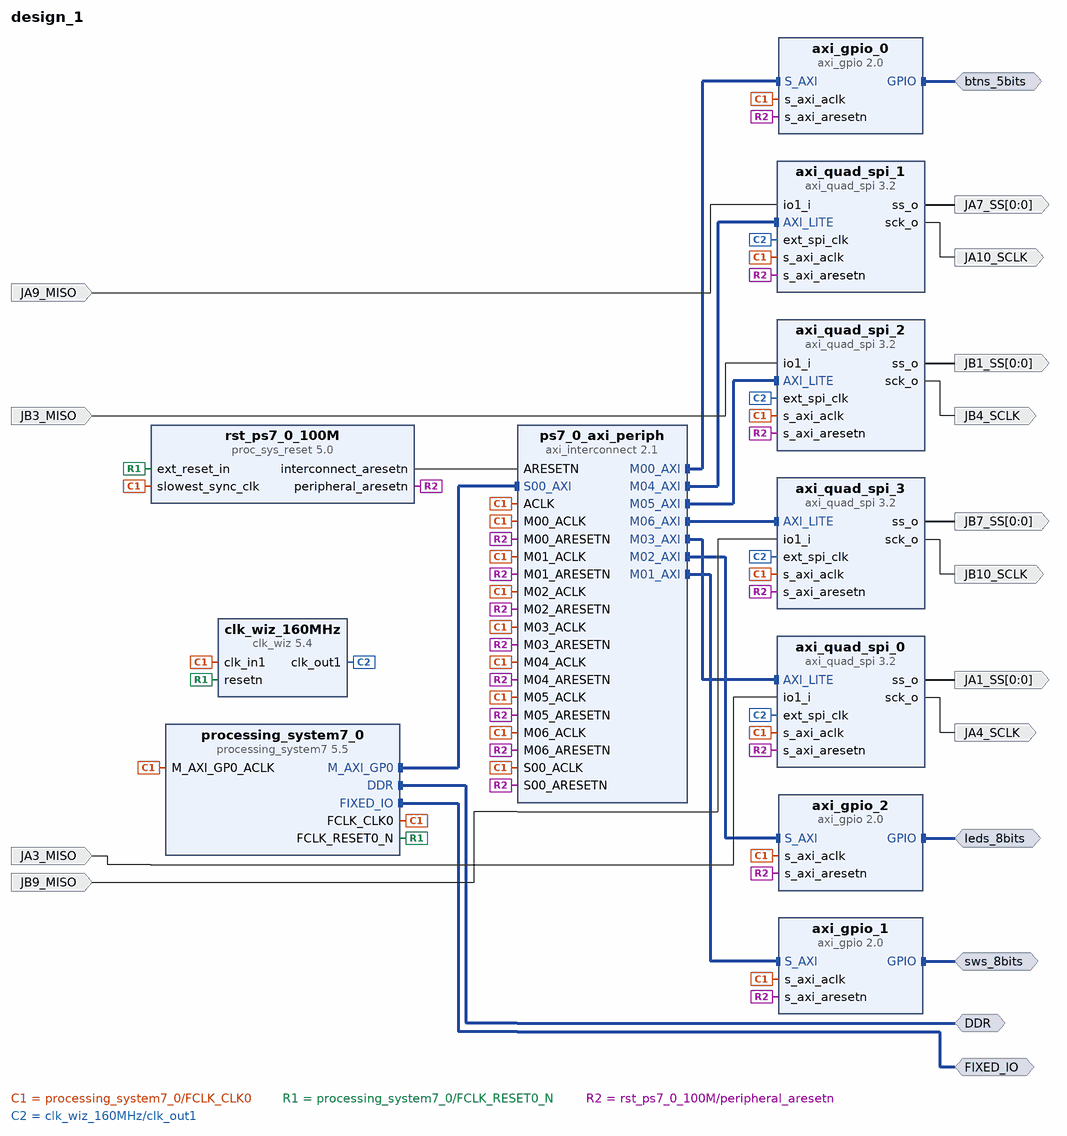
[diagram p0: block diagram of the top level]
# Vivado block design design_1, xc7z020clg484-1, Vivado 2017.1_sdx
create_bd_design design_1

create_bd_intf_port -mode Master -vlnv xilinx.com:interface:ddrx_rtl:1.0 DDR
create_bd_intf_port -mode Master -vlnv xilinx.com:display_processing_system7:fixedio_rtl:1.0 FIXED_IO
create_bd_intf_port -mode Master -vlnv xilinx.com:interface:gpio_rtl:1.0 btns_5bits
create_bd_intf_port -mode Master -vlnv xilinx.com:interface:gpio_rtl:1.0 sws_8bits
create_bd_intf_port -mode Master -vlnv xilinx.com:interface:gpio_rtl:1.0 leds_8bits
create_bd_port -dir O -type clk JA4_SCLK
create_bd_port -dir I JA3_MISO
create_bd_port -dir O -from 0 -to 0 JA1_SS
create_bd_port -dir O -from 0 -to 0 JA7_SS
create_bd_port -dir O -from 0 -to 0 JB1_SS
create_bd_port -dir O -from 0 -to 0 JB7_SS
create_bd_port -dir I JA9_MISO
create_bd_port -dir I JB3_MISO
create_bd_port -dir O -type clk JA10_SCLK
create_bd_port -dir O -type clk JB4_SCLK
create_bd_port -dir O -type clk JB10_SCLK
create_bd_port -dir I JB9_MISO

create_bd_cell -type ip -vlnv xilinx.com:ip:processing_system7:5.5 processing_system7_0
set_property -dict [list \
  CONFIG.PCW_FPGA0_PERIPHERAL_FREQMHZ 100 \
  CONFIG.PCW_FPGA1_PERIPHERAL_FREQMHZ 160 \
  CONFIG.PCW_UART0_BAUD_RATE 921600 \
  CONFIG.PCW_QSPI_GRP_SINGLE_SS_ENABLE 1 \
  CONFIG.PCW_UART0_PERIPHERAL_ENABLE 1 \
  CONFIG.PCW_UART0_UART0_IO {MIO 10 .. 11} \
  CONFIG.preset ZedBoard \
] [get_bd_cells processing_system7_0]
# 9 more settings of processing_system7_0 are not shown: defaults, MIO pin electricals, DDR timing, and values the tool derives
create_bd_cell -type ip -vlnv xilinx.com:ip:axi_gpio:2.0 axi_gpio_0
set_property -dict [list \
  CONFIG.C_INTERRUPT_PRESENT 0 \
  CONFIG.USE_BOARD_FLOW true \
  CONFIG.GPIO_BOARD_INTERFACE btns_5bits \
] [get_bd_cells axi_gpio_0]
create_bd_cell -type ip -vlnv xilinx.com:ip:axi_gpio:2.0 axi_gpio_1
set_property -dict [list \
  CONFIG.C_INTERRUPT_PRESENT 0 \
  CONFIG.USE_BOARD_FLOW true \
  CONFIG.GPIO_BOARD_INTERFACE sws_8bits \
] [get_bd_cells axi_gpio_1]
create_bd_cell -type ip -vlnv xilinx.com:ip:axi_gpio:2.0 axi_gpio_2
set_property -dict [list \
  CONFIG.C_INTERRUPT_PRESENT 0 \
  CONFIG.USE_BOARD_FLOW true \
  CONFIG.GPIO_BOARD_INTERFACE leds_8bits \
] [get_bd_cells axi_gpio_2]
create_bd_cell -type ip -vlnv xilinx.com:ip:axi_interconnect:2.1 ps7_0_axi_periph
set_property -dict {CONFIG.NUM_MI 7} [get_bd_cells ps7_0_axi_periph]
create_bd_cell -type ip -vlnv xilinx.com:ip:axi_quad_spi:3.2 axi_quad_spi_0
set_property -dict [list \
  CONFIG.C_USE_STARTUP 0 \
  CONFIG.C_NUM_TRANSFER_BITS 16 \
  CONFIG.C_NUM_SS_BITS 1 \
  CONFIG.C_SCK_RATIO 2 \
  CONFIG.C_FIFO_DEPTH 16 \
  CONFIG.FIFO_INCLUDED 1 \
  CONFIG.Multiples16 4 \
] [get_bd_cells axi_quad_spi_0]
create_bd_cell -type ip -vlnv xilinx.com:ip:axi_quad_spi:3.2 axi_quad_spi_1
set_property -dict [list \
  CONFIG.C_USE_STARTUP 0 \
  CONFIG.C_NUM_TRANSFER_BITS 16 \
  CONFIG.C_NUM_SS_BITS 1 \
  CONFIG.C_SCK_RATIO 2 \
  CONFIG.C_FIFO_DEPTH 16 \
  CONFIG.FIFO_INCLUDED 1 \
  CONFIG.Multiples16 4 \
] [get_bd_cells axi_quad_spi_1]
create_bd_cell -type ip -vlnv xilinx.com:ip:axi_quad_spi:3.2 axi_quad_spi_2
set_property -dict [list \
  CONFIG.C_USE_STARTUP 0 \
  CONFIG.C_NUM_TRANSFER_BITS 16 \
  CONFIG.C_NUM_SS_BITS 1 \
  CONFIG.C_SCK_RATIO 2 \
  CONFIG.C_FIFO_DEPTH 16 \
  CONFIG.FIFO_INCLUDED 1 \
  CONFIG.Multiples16 4 \
] [get_bd_cells axi_quad_spi_2]
create_bd_cell -type ip -vlnv xilinx.com:ip:axi_quad_spi:3.2 axi_quad_spi_3
set_property -dict [list \
  CONFIG.C_USE_STARTUP 0 \
  CONFIG.C_NUM_TRANSFER_BITS 16 \
  CONFIG.C_NUM_SS_BITS 1 \
  CONFIG.C_SCK_RATIO 2 \
  CONFIG.C_FIFO_DEPTH 16 \
  CONFIG.FIFO_INCLUDED 1 \
  CONFIG.Multiples16 4 \
] [get_bd_cells axi_quad_spi_3]
create_bd_cell -type ip -vlnv xilinx.com:ip:proc_sys_reset:5.0 rst_ps7_0_100M
create_bd_cell -type ip -vlnv xilinx.com:ip:clk_wiz:5.4 clk_wiz_160MHz
set_property -dict [list \
  CONFIG.CLKOUT1_REQUESTED_OUT_FREQ 160 \
  CONFIG.USE_LOCKED false \
  CONFIG.RESET_PORT resetn \
  CONFIG.MMCM_DIVCLK_DIVIDE 1 \
  CONFIG.MMCM_CLKOUT0_DIVIDE_F 6.250 \
  CONFIG.RESET_TYPE ACTIVE_LOW \
  CONFIG.CLKOUT1_JITTER 119.657 \
] [get_bd_cells clk_wiz_160MHz]

# ---- connections ----

connect_bd_intf_net [get_bd_intf_pins processing_system7_0/M_AXI_GP0] [get_bd_intf_pins ps7_0_axi_periph/S00_AXI]
connect_bd_intf_net [get_bd_intf_pins ps7_0_axi_periph/M00_AXI] [get_bd_intf_pins axi_gpio_0/S_AXI]
connect_bd_intf_net [get_bd_intf_pins ps7_0_axi_periph/M01_AXI] [get_bd_intf_pins axi_gpio_1/S_AXI]
connect_bd_intf_net [get_bd_intf_pins ps7_0_axi_periph/M02_AXI] [get_bd_intf_pins axi_gpio_2/S_AXI]
connect_bd_intf_net [get_bd_intf_pins ps7_0_axi_periph/M03_AXI] [get_bd_intf_pins axi_quad_spi_0/AXI_LITE]
connect_bd_intf_net [get_bd_intf_pins ps7_0_axi_periph/M04_AXI] [get_bd_intf_pins axi_quad_spi_1/AXI_LITE]
connect_bd_intf_net [get_bd_intf_pins ps7_0_axi_periph/M05_AXI] [get_bd_intf_pins axi_quad_spi_2/AXI_LITE]
connect_bd_intf_net [get_bd_intf_pins ps7_0_axi_periph/M06_AXI] [get_bd_intf_pins axi_quad_spi_3/AXI_LITE]
connect_bd_intf_net [get_bd_intf_ports DDR] [get_bd_intf_pins processing_system7_0/DDR]
connect_bd_intf_net [get_bd_intf_ports FIXED_IO] [get_bd_intf_pins processing_system7_0/FIXED_IO]
connect_bd_intf_net [get_bd_intf_ports btns_5bits] [get_bd_intf_pins axi_gpio_0/GPIO]
connect_bd_intf_net [get_bd_intf_ports sws_8bits] [get_bd_intf_pins axi_gpio_1/GPIO]
connect_bd_intf_net [get_bd_intf_ports leds_8bits] [get_bd_intf_pins axi_gpio_2/GPIO]
connect_bd_net [get_bd_pins processing_system7_0/FCLK_CLK0] \
  [get_bd_pins processing_system7_0/M_AXI_GP0_ACLK] [get_bd_pins axi_gpio_0/s_axi_aclk] [get_bd_pins axi_gpio_1/s_axi_aclk] \
  [get_bd_pins axi_gpio_2/s_axi_aclk] [get_bd_pins axi_quad_spi_0/s_axi_aclk] [get_bd_pins axi_quad_spi_1/s_axi_aclk] \
  [get_bd_pins axi_quad_spi_2/s_axi_aclk] [get_bd_pins axi_quad_spi_3/s_axi_aclk] \
  [get_bd_pins rst_ps7_0_100M/slowest_sync_clk] [get_bd_pins clk_wiz_160MHz/clk_in1] [get_bd_pins ps7_0_axi_periph/S00_ACLK] \
  [get_bd_pins ps7_0_axi_periph/M00_ACLK] [get_bd_pins ps7_0_axi_periph/ACLK] [get_bd_pins ps7_0_axi_periph/M01_ACLK] \
  [get_bd_pins ps7_0_axi_periph/M02_ACLK] [get_bd_pins ps7_0_axi_periph/M03_ACLK] [get_bd_pins ps7_0_axi_periph/M04_ACLK] \
  [get_bd_pins ps7_0_axi_periph/M05_ACLK] [get_bd_pins ps7_0_axi_periph/M06_ACLK]
connect_bd_net [get_bd_pins processing_system7_0/FCLK_RESET0_N] [get_bd_pins rst_ps7_0_100M/ext_reset_in] [get_bd_pins clk_wiz_160MHz/resetn]
connect_bd_net [get_bd_pins rst_ps7_0_100M/peripheral_aresetn] \
  [get_bd_pins axi_gpio_0/s_axi_aresetn] [get_bd_pins axi_gpio_1/s_axi_aresetn] [get_bd_pins axi_gpio_2/s_axi_aresetn] \
  [get_bd_pins axi_quad_spi_0/s_axi_aresetn] [get_bd_pins axi_quad_spi_1/s_axi_aresetn] \
  [get_bd_pins axi_quad_spi_2/s_axi_aresetn] [get_bd_pins axi_quad_spi_3/s_axi_aresetn] \
  [get_bd_pins ps7_0_axi_periph/S00_ARESETN] [get_bd_pins ps7_0_axi_periph/M00_ARESETN] \
  [get_bd_pins ps7_0_axi_periph/M01_ARESETN] [get_bd_pins ps7_0_axi_periph/M02_ARESETN] \
  [get_bd_pins ps7_0_axi_periph/M03_ARESETN] [get_bd_pins ps7_0_axi_periph/M04_ARESETN] \
  [get_bd_pins ps7_0_axi_periph/M05_ARESETN] [get_bd_pins ps7_0_axi_periph/M06_ARESETN]
connect_bd_net [get_bd_pins rst_ps7_0_100M/interconnect_aresetn] [get_bd_pins ps7_0_axi_periph/ARESETN]
connect_bd_net [get_bd_pins axi_quad_spi_0/sck_o] [get_bd_ports JA4_SCLK]
connect_bd_net -net JB3_1 [get_bd_ports JA3_MISO] [get_bd_pins axi_quad_spi_0/io1_i]
connect_bd_net [get_bd_pins axi_quad_spi_0/ss_o] [get_bd_ports JA1_SS]
connect_bd_net [get_bd_pins axi_quad_spi_1/ss_o] [get_bd_ports JA7_SS]
connect_bd_net [get_bd_pins axi_quad_spi_2/ss_o] [get_bd_ports JB1_SS]
connect_bd_net [get_bd_pins axi_quad_spi_3/ss_o] [get_bd_ports JB7_SS]
connect_bd_net -net MISO_B_1 [get_bd_ports JA9_MISO] [get_bd_pins axi_quad_spi_1/io1_i]
connect_bd_net -net MISO_C_1 [get_bd_ports JB3_MISO] [get_bd_pins axi_quad_spi_2/io1_i]
connect_bd_net [get_bd_pins axi_quad_spi_1/sck_o] [get_bd_ports JA10_SCLK]
connect_bd_net [get_bd_pins axi_quad_spi_2/sck_o] [get_bd_ports JB4_SCLK]
connect_bd_net [get_bd_pins axi_quad_spi_3/sck_o] [get_bd_ports JB10_SCLK]
connect_bd_net -net MISO_A3_1 [get_bd_ports JB9_MISO] [get_bd_pins axi_quad_spi_3/io1_i]
connect_bd_net -net clk_wiz_0_clk_out1 [get_bd_pins clk_wiz_160MHz/clk_out1] \
  [get_bd_pins axi_quad_spi_0/ext_spi_clk] [get_bd_pins axi_quad_spi_1/ext_spi_clk] [get_bd_pins axi_quad_spi_2/ext_spi_clk] \
  [get_bd_pins axi_quad_spi_3/ext_spi_clk]

# ---- address map ----
assign_bd_address -offset 0x41200000 -range 64K -target_address_space [get_bd_addr_spaces processing_system7_0/Data] [get_bd_addr_segs axi_gpio_0/S_AXI/Reg]
assign_bd_address -offset 0x41210000 -range 64K -target_address_space [get_bd_addr_spaces processing_system7_0/Data] [get_bd_addr_segs axi_gpio_1/S_AXI/Reg]
assign_bd_address -offset 0x41220000 -range 64K -target_address_space [get_bd_addr_spaces processing_system7_0/Data] [get_bd_addr_segs axi_gpio_2/S_AXI/Reg]
assign_bd_address -offset 0x41E00000 -range 64K -target_address_space [get_bd_addr_spaces processing_system7_0/Data] [get_bd_addr_segs axi_quad_spi_0/AXI_LITE/Reg]
assign_bd_address -offset 0x41E10000 -range 64K -target_address_space [get_bd_addr_spaces processing_system7_0/Data] [get_bd_addr_segs axi_quad_spi_1/AXI_LITE/Reg]
assign_bd_address -offset 0x41E20000 -range 64K -target_address_space [get_bd_addr_spaces processing_system7_0/Data] [get_bd_addr_segs axi_quad_spi_2/AXI_LITE/Reg]
assign_bd_address -offset 0x41E30000 -range 64K -target_address_space [get_bd_addr_spaces processing_system7_0/Data] [get_bd_addr_segs axi_quad_spi_3/AXI_LITE/Reg]

validate_bd_design
save_bd_design
